# Altium project eLFL_Particle_Breakout.PrjPcb
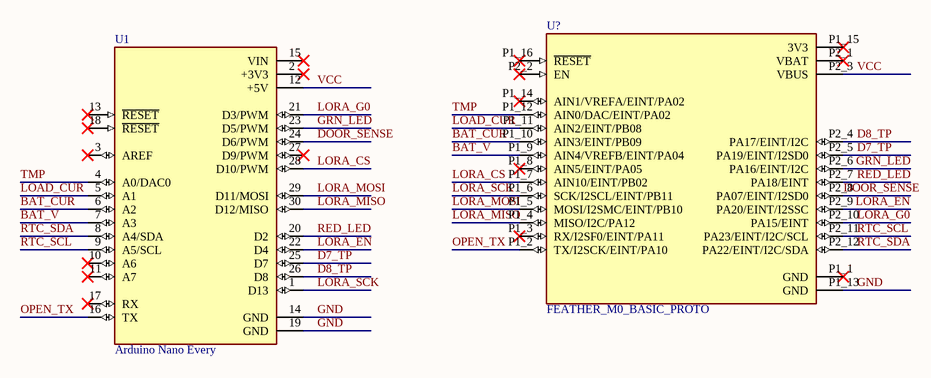
[diagram p0: Nano_Particle_Breakout.SchDoc]
1 sheet, 2 parts. Net scope: global (net labels, ports and power ports of the same name join across sheets).
Board file: Nano_Particle_Breakout.PcbDoc

## Sheet Nano_Particle_Breakout.SchDoc: eLFL Nano-to-Particle Breakout
size A; Author: Christian Martinez; CompanyName: eLFL; Organization: WEMPEC; SheetNumber: 1; SheetTotal: 1

### Parts
Particle_Boron/Argon  FEATHER_M0_BASIC_PROTO  [Particle_Module]
U1  Arduino Nano Every  [Arduino Plug]

### Nets
BAT_CUR: Particle_Boron/Argon.P1_10(AIN3/EINT/PB09) U1.6(A2)
BAT_V: Particle_Boron/Argon.P1_9(AIN4/VREFB/EINT/PA04) U1.7(A3)
D7_TP: Particle_Boron/Argon.P2_5(PA19/EINT/I2SD0) U1.25(D7)
D8_TP: Particle_Boron/Argon.P2_4(PA17/EINT/I2C) U1.26(D8)
DOOR_SENSE: Particle_Boron/Argon.P2_8(PA07/EINT/I2SD0) U1.24(D6/PWM)
GND: Particle_Boron/Argon.P1_13(GND) U1.14(GND) U1.19(GND)
GRN_LED: Particle_Boron/Argon.P2_6(PA16/EINT/I2C) U1.23(D5/PWM)
LOAD_CUR: Particle_Boron/Argon.P1_11(AIN2/EINT/PB08) U1.5(A1)
LORA_CS: Particle_Boron/Argon.P1_7(AIN10/EINT/PB02) U1.28(D10/PWM)
LORA_EN: Particle_Boron/Argon.P2_9(PA20/EINT/I2SSC) U1.22(D4)
LORA_G0: Particle_Boron/Argon.P2_10(PA15/EINT) U1.21(D3/PWM)
LORA_MISO: Particle_Boron/Argon.P1_4(MISO/I2C/PA12) U1.30(D12/MISO)
LORA_MOSI: Particle_Boron/Argon.P1_5(MOSI/I2SMC/EINT/PB10) U1.29(D11/MOSI)
LORA_SCK: Particle_Boron/Argon.P1_6(SCK/I2SCL/EINT/PB11) U1.1(D13)
OPEN_TX: Particle_Boron/Argon.P1_2(TX/I2SCK/EINT/PA10) U1.16(TX)
RED_LED: Particle_Boron/Argon.P2_7(PA18/EINT) U1.20(D2)
RTC_SCL: Particle_Boron/Argon.P2_11(PA23/EINT/I2C/SCL) U1.9(A5/SCL)
RTC_SDA: Particle_Boron/Argon.P2_12(PA22/EINT/I2C/SDA) U1.8(A4/SDA)
TMP: Particle_Boron/Argon.P1_12(AIN0/DAC/EINT/PA02) U1.4(A0/DAC0)
VCC: Particle_Boron/Argon.P2_3(VBUS) U1.12(+5V)

Not connected (* = marked no-connect by the designer): Particle_Boron/Argon P1_1(GND)* P1_3(RX/I2SF0/EINT/PA11)* P1_8(AIN5/EINT/PA05)* P1_14(AIN1/VREFA/EINT/PA02)* P1_15(3V3)* P1_16(~{RESET})* P2_1(VBAT)* P2_2(EN)*; U1 2(+3V3)* 3(AREF)* 10(A6)* 11(A7)* 13(~{RESET})* 15(VIN)* 17(RX)* 18(~{RESET})* 27(D9/PWM)*

### Library data of the parts
Particle_Boron/Argon = FEATHER_M0_BASIC_PROTO: ATSAMD21G18 Feather M0 Basic Proto SAM D ARMÂ® CortexÂ®-M0+ MCU 32-Bit Embedded Evaluation Board; MF: {'manufacturer': u'Adafruit Industries'}
U1 = ABX00028: ATmega4809 Arduino Nano Every AVR AVR MCU 8-Bit Embedded Evaluation Board; MF: {'manufacturer': u'Arduino'}; Package: None; MP: ABX00028; Value: *; Availability: Unavailable; Price: None